# Altium schematic sheet Menu_Navigators.SchDoc
size A; SheetNumber: 5; SheetTotal: 5
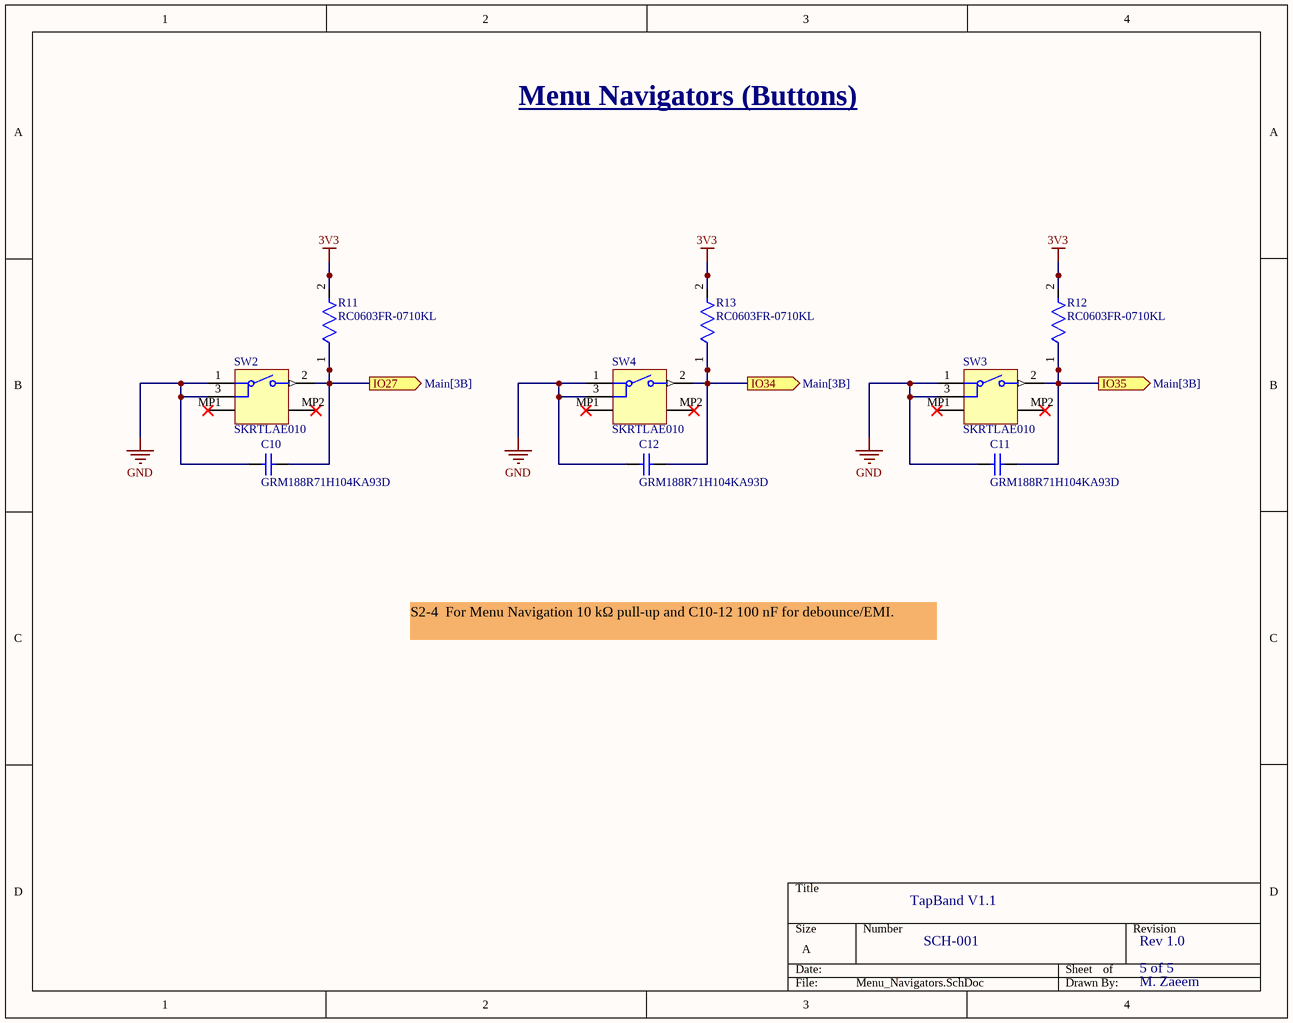
[diagram p0: Menu_Navigators.SchDoc]

## Parts
C10  GRM188R71H104KA93D  [CAPC1608X90X35ML10T15]
C11  GRM188R71H104KA93D  [CAPC1608X90X35ML10T15]
C12  GRM188R71H104KA93D  [CAPC1608X90X35ML10T15]
R11  RC0603FR-0710KL  [FP-RC0603-0_55-IPC_C]
R12  RC0603FR-0710KL  [FP-RC0603-0_55-IPC_C]
R13  RC0603FR-0710KL  [FP-RC0603-0_55-IPC_C]
SW2  SKRTLAE010  [ALPS-SKRTLAE010_V]
SW3  SKRTLAE010  [ALPS-SKRTLAE010_V]
SW4  SKRTLAE010  [ALPS-SKRTLAE010_V]

## Ports
IO27 (out, see Main[3B]), IO34 (out, see Main[3B]), IO35 (out, see Main[3B])

## Nets
3V3: R11.2 R12.2 R13.2
GND: C10.2 C11.2 C12.2 SW2.1 SW2.3 SW3.1 SW3.3 SW4.1 SW4.3
IO27: C10.1 R11.1 SW2.2 ; port IO27
IO34: C12.1 R13.1 SW4.2 ; port IO34
IO35: C11.1 R12.1 SW3.2 ; port IO35

Not connected (* = marked no-connect by the designer): SW2 MP1* MP2*; SW3 MP1* MP2*; SW4 MP1* MP2*

## Notes on the sheet
- Menu Navigators (Buttons)
- S2-4  For Menu Navigation 10 kΩ pull‑up and C10-12 100 nF for debounce/EMI.
- TapBand V1.1
- SCH-001
- Rev 1.0
- 5 of 5
- M. Zaeem

## Library data of the parts
C10-C12 = CMP-2100-03643-1: Chip Capacitor, 0.1 uF, +/- 10%, 50 V, -55 to 125 degC, 0603 (1608 Metric), RoHS, Tape and Reel; Manufacturer: Murata; Dielectric Material: Ceramic; Voltage Rating: 50V; Capacitance: 100nF; Dielectric: X7R; Insulation Resistance: 10GR; Case Code (Metric): 1608; Lead Free: LeadFree; Depth: 0.8mm; Number of Pins: 2; Radiation Hardening: No; Case/Package: 0603; Manufacturer URL: http://www.murata.com/; Packaging: TapeandReel; Length: 1.6mm; Contact Plating: Tin; Datasheet URL: http://psearch.en.murata.com/capacitor/product/GRM188R71H104KA93%23.pdf; Tolerance: 10%; Case Code (Imperial): 0603; Min Operating Temperature: -55degC; RoHSCompliant: true; Voltage: 50V; Termination: SMD/SMT; Mount: SurfaceMount; Material: Ceramic; Package Quantity: 1; Height: 0.8mm; Thickness: 0.035inch; REACH SVHC: NoSVHC; Max Operating Temperature: 125degC; Width: 0.8mm; Package Reference: 0603; Voltage Rating (DC): 50V; Datasheet Version: 42675.0; Package Description: 2-Pin Surface Mount Device, Body 1.6 x 0.8 mm
R11-R13 = CMP-2100-03664-2: RES 10K OHM 1% 1/10W 0603; Voltage Rating: 75V; Voltage Rating (DC): 50V; Resistance: 10kR; Power Rating: 100mW; Temperature Coefficient: 100ppm/°C; Depth: 0.8mm; Termination: SMD/SMT; Resistor Type: Thick Film; Series: RC; Construction: Rectangular; Features: Moisture Resistant; Packaging: Tape and Reel; Min Operating Temperature: -55°C; Number of Terminations: 2; Lead Pitch: 0.3mm; RoHS Compliant: Yes; Case/Package: 0603; Resistance Tolerance: 1%; Military Standard: Not; Weight: 7.1E-05oz; Number of Pins: 2; Tolerance: 1%; Length: 1.6mm; Case Code (Imperial): 0603; Lead Free: Lead Free; Width: 0.8mm; Max Power Dissipation: 100mW; Height: 0.45mm; Max Operating Temperature: 155°C; Case Code (Metric): 1608; Size Code: 0603
SW2-SW4 = CMP-2000-07073-2: Side Push Type, 250 V, -40 to 90 degC, 3-Pin SMD, RoHS, Tape and Reel; Manufacturer: ALPS; Operating Force: 1.6N; Folder: Unified Components\Components\New Releases\New\; Maximum Current Rating: 0.05@12VDCA; RevisionId: 1; Pole Throw Configuration: SPST; Switch Configuration: N.O.; AccessRights: 2147483647; Maximum DC Voltage Rating: 12V; ContentType: Unified Component; Rad Hard: No; Mounting: SurfaceMount; Datasheet URL: http://www.alps.com/prod/info/E/PDF/Tact/SurfaceMount/SKRT/SKRT.PDF; Manufacturer URL: http://www.alps.com/e/; ReleaseDate: 22/09/2017 06:13:25 AM; ItemHRID: CMP-2000-07073; ContentTypeGUID: CB3C11C4-E317-11DF-B822-12313F0024A2; LifeCycle: Released; ItemGUID: EAC55BEC-37DC-4BDB-8BA7-D75E6D5C3D75; Packaging: Tape&Reel; Package Reference: SKRTLAE010; FolderGUID: B7F4506A-9127-42E7-A087-46FE7B18D116; Datasheet Version: 06/2015; Mounting Technology: SurfaceMount; LifeCycleStateGUID: 61E382EE-6656-4F12-9E24-BE9327104A25; Package Description: 3-Pin Surface Mount Device, Body 4.5 x 3.55 mm, Pitch 1.225 mm